# Altium schematic sheet Schematic.SchDoc
size A4
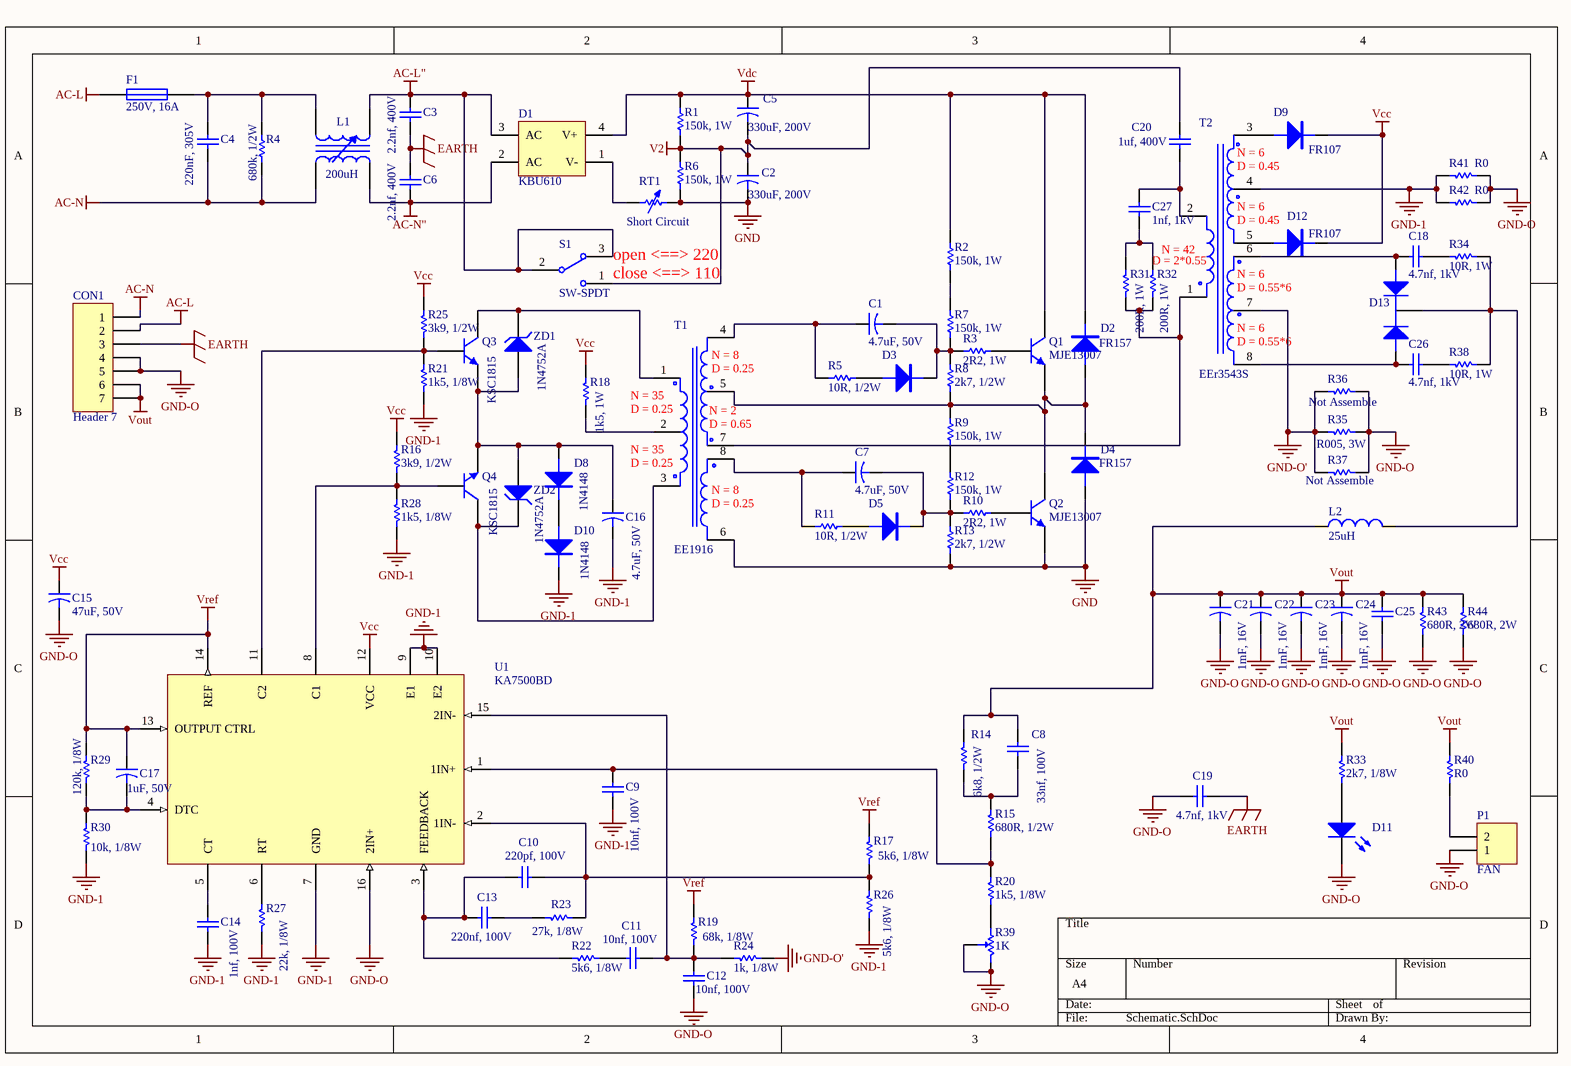
[diagram p0: Schematic.SchDoc]

## Parts
C1  4.7uF, 50V  [CAP-P2.54-D6]
C2  330uF, 200V  [C_EL_20X35]
C3  2.2nf, 400V  [C_CER_D7C]
C4  220nF, 305V  [CAP-pitch15]
C5  330uF, 200V  [C_EL_20X35]
C6  2.2nf, 400V  [C_CER_D7C]
C7  4.7uF, 50V  [CAP-P2.54-D6]
C8  33nf, 100V  [RAD0.2-1]
C9  10nf, 100V  [RAD0.2-1]
C10  220pf, 100V  [RAD0.2-1]
C11  10nf, 100V  [RAD0.2-1]
C12  10nf, 100V  [RAD0.2-1]
C13  220nf, 100V  [RAD0.2-1]
C14  1nf, 100V  [RAD0.2-1]
C15  47uF, 50V  [CAP-P2.54-D6]
C16  4.7uF, 50V  [CAP-P2.54-D6]
C17  1uF, 50V  [CAP-P2.54-D6]
C18  4.7nf, 1kV  [C_CER_D6B]
C19  4.7nf, 1kV  [RAD0.2-1]
C20  1uf, 400V  [C_PLY_22X7]
C21  1mF, 16V  [RB.2/.6-2]
C22  1mF, 16V  [RB.2/.6-2]
C23  1mF, 16V  [RB.2/.6-2]
C24  1mF, 16V  [RB.2/.6-2]
C25  (no value)  [C_CER_D6B]
C26  4.7nf, 1kV  [C_CER_D6B]
C27  1nf, 1kV  [C_CER_D6B]
CON1  Header 7  [barrier-terminal-7P]
D1  KBU610  [Diode-12]
D2  FR157  [D_AX05_DO15]
D3  (no value)  [D_AX04_DO41]
D4  FR157  [D_AX05_DO15]
D5  (no value)  [D_AX04_DO41]
D8  1N4148  [D_AX03_DO35]
D9  FR107  [D_AX04_DO41]
D10  1N4148  [D_AX03_DO35]
D11  LED RED  [LED3MM]  (value not drawn)
D12  FR107  [D_AX04_DO41]
D13  MBR20200CT  [TO-220ne3]  (value not drawn)
F1  250V, 16A  [Fuse -10]
L1  200uH  [Trans-11]
L2  25uH  [inductor-6]
P1  FAN  [XH_2]
Q1  MJE13007  [TO-220ne3]
Q2  MJE13007  [TO-220ne3]
Q3  KSC1815  [TO92_3B]
Q4  KSC1815  [TO92_3B]
R1  150k, 1W  [R05W_AX05]
R2  150k, 1W  [R05W_AX05]
R3  2R2, 1W  [R05W_AX05]
R4  680k, 1/2W  [R05W_AX05]
R5  10R, 1/2W  [R025W_AX04]
R6  150k, 1W  [R05W_AX05]
R7  150k, 1W  [R05W_AX05]
R8  2k7, 1/2W  [R025W_AX04]
R9  150k, 1W  [R05W_AX05]
R10  2R2, 1W  [R05W_AX05]
R11  10R, 1/2W  [R025W_AX04]
R12  150k, 1W  [R05W_AX05]
R13  2k7, 1/2W  [R025W_AX04]
R14  6k8, 1/2W  [R025W_AX04]
R15  680R, 1/2W  [R025W_AX04]
R16  3k9, 1/2W  [R025W_AX04]
R17  5k6, 1/8W  [R0125W_AX025]
R18  1k5, 1W  [R05W_AX05]
R19  68k, 1/8W  [R0125W_AX025]
R20  1k5, 1/8W  [R0125W_AX025]
R21  1k5, 1/8W  [R0125W_AX025]
R22  5k6, 1/8W  [R0125W_AX025]
R23  27k, 1/8W  [R0125W_AX025]
R24  1k, 1/8W  [R0125W_AX025]
R25  3k9, 1/2W  [R025W_AX04]
R26  5k6, 1/8W  [R0125W_AX025]
R27  22k, 1/8W  [R0125W_AX025]
R28  1k5, 1/8W  [R0125W_AX025]
R29  120k, 1/8W  [R0125W_AX025]
R30  10k, 1/8W  [R0125W_AX025]
R31  200R, 1W  [R1W_AX06]
R32  200R, 1W  [R1W_AX06]
R33  2k7, 1/8W  [R0125W_AX025]
R34  10R, 1W  [R05W_AX05]
R35  R005, 3W  [J10MM]
R36  Not Assemble  [J10MM]
R37  Not Assemble  [J10MM]
R38  10R, 1W  [R05W_AX05]
R39  1K  [Pot 00]
R40  R0  [J10MM]
R41  R0  [J7P6MM]
R42  R0  [J7P6MM]
R43  680R, 2W  [R1W_AX06]
R44  680R, 2W  [R1W_AX06]
RT1  Short Circuit  [J7P6MM]
S1  SW-SPDT  [Switch - SPDT]
T1  EE1916  [EE1916-3]
T2  EEr3543S  [EFD30_12]
U1  KA7500BD  [Dip-16pin]
ZD1  1N4752A  [Diode 1W]
ZD2  1N4752A  [Diode 1W]

## Nets
AC-L: CON1.2 F1.2
AC-L": C3.1 D1.3(AC) L1.2 S1.2 S1.3
AC-N: C4.2 CON1.1 L1.1 R4.2
AC-N": C6.2 D1.2(AC) L1.3
EARTH: C3.2 C6.1 C19.2 CON1.3
GND: C2.2 D4.1 Q2.1(E) R6.2 R13.2 RT1.2 T1.6
GND-1: C9.2 C14.2 C16.2 D10.2 R21.2 R26.2 R27.2 R28.2 R30.2 R41.2 R42.2 T2.4 U1.7(GND) U1.9(E1) U1.10(E2)
GND-O: C12.1 C15.2 C19.1 C21.2 C22.2 C23.2 C24.2 C25.2 CON1.4 CON1.5 D11.2(K) P1.1 R35.2 R36.1 R37.2 R39.1(CCW) R39.3(Setpoint) R41.1 R42.1 R43.1 R44.1 U1.16(2IN+)
GND-O': R24.2 R35.1 R36.2 R37.1 T2.7
V2: C2.1 C5.2 C20.1 R1.2 R6.1 S1.1
Vcc: C15.1 D9.2 D12.2 R16.1 R18.2 R25.1 U1.12(VCC)
Vdc: C5.1 D1.4(V+) D2.2 Q1.2(C) R1.1 R2.1
Vout: C8.1 C21.1 C22.1 C23.1 C24.1 C25.1 CON1.6 CON1.7 L2.1 R14.1 R33.1 R40.2 R43.2 R44.2
Vref: C17.1 R17.1 R19.1 R29.2 U1.13(OUTPUT_CTRL) U1.14(REF)
NetC1_1: C1.1 R5.2 T1.4
NetC1_2: C1.2 D3.2 R3.2 R7.2 R8.1
NetC4_1: C4.1 F1.1 L1.4 R4.1
NetC7_1: C7.1 R11.2 T1.8
NetC7_2: C7.2 D5.2 R10.2 R12.2 R13.1
NetC8_2: C8.2 R14.2 R15.1
NetC9_1: C9.1 R15.2 R20.2 U1.1(1IN+)
NetC10_1: C10.1 C13.1 R22.1 U1.3(FEEDBACK)
NetC10_2: C10.2 R17.2 R23.2 R26.1 U1.2(1IN-)
NetC11_1: C11.1 R22.2
NetC11_2: C11.2 C12.2 R19.2 R24.1 U1.15(2IN-)
NetC13_2: C13.2 R23.1
NetC14_1: C14.1 U1.5(CT)
NetC16_1: C16.1 D8.1 Q3.1(E) Q4.1(E) ZD1.1(A) ZD2.1(A)
NetC17_2: C17.2 R29.1 R30.1 U1.4(DTC)
NetC18_1: C18.1 R34.2
NetC18_2: C18.2 D13.3 T2.6
NetC20_2: C20.2 C27.1 T2.2
NetC26_1: C26.1 D13.1 T2.8
NetC26_2: C26.2 R38.2
NetC27_2: C27.2 R31.2 R32.2
NetD1_1: D1.1(V-) RT1.1
NetD2_1: D2.1 D4.2 Q1.1(E) Q2.2(C) R8.2 R9.1 T1.5
NetD3_1: D3.1 R5.1
NetD5_1: D5.1 R11.1
NetD8_2: D8.2 D10.1
NetD9_1: D9.1 T2.3
NetD11_1: D11.1(A) R33.2
NetD12_1: D12.1 T2.5
NetD13_2: D13.2 L2.2 R34.1 R38.1
NetP1_2: P1.2 R40.1
NetQ1_3: Q1.3(B) R3.1
NetQ2_3: Q2.3(B) R10.1
NetQ3_2: Q3.2(C) T1.1 ZD1.2(K)
NetQ3_3: Q3.3(B) R21.1 R25.2 U1.11(C2)
NetQ4_2: Q4.2(C) T1.3 ZD2.2(K)
NetQ4_3: Q4.3(B) R16.2 R28.1 U1.8(C1)
NetR2_2: R2.2 R7.1
NetR9_2: R9.2 R12.1
NetR18_1: R18.1 T1.2
NetR20_1: R20.1 R39.2(CW)
NetR27_1: R27.1 U1.6(RT)
NetR31_1: R31.1 R32.1 T1.7 T2.1

## Notes on the sheet
- (near T2) N = 6
- (near T2) D = 0.45
- D = 2*0.55
- N = 42
- open <==> 220                          close <==> 110
- (near T2) D = 0.55*6
- (near T1) N = 35
- (near T1) N = 8
- (near T1) D = 0.25
- (near T1) N = 2
- (near T1) D = 0.65

## Library data of the parts
C1 C2 C5 C7 C15-C17 C21-C24 = Cap2: 200V, 330uF; Category: Capacitor; Mounting Style: Through hole
  C1 C7 C16: Part Number: 4.7uF, 50V
  C2 C5: Part Number: 330uF, 200V
  C15: Part Number: 47uF, 50V
  C17: Part Number: 1uF, 50V
  C21-C24: Part Number: 1mF, 16V
C3 C6 = Cap: jn222m; Category: Capacitor; Mounting Style: Through hole; Part Number: 2.2nf, 400V
C4 = Cap: mkp62 x2  224 k 305v; Category: Capacitor; Mounting Style: Through hole; Part Number: 220nF, 305V
C8 = Cap: 2A333j; Category: Capacitor; Mounting Style: Through hole; Part Number: 33nf, 100V
C9 C11 C12 = Cap: 2A103j; Category: Capacitor; Mounting Style: Through hole; Part Number: 10nf, 100V
C10 = Cap: 2A221j; Category: Capacitor; Mounting Style: Through hole; Part Number: 220pf, 100V
C13 = Cap: 2A223j; Category: Capacitor; Mounting Style: Through hole; Part Number: 220nf, 100V
C14 = Cap: 2A102j; Category: Capacitor; Mounting Style: Through hole; Part Number: 1nf, 100V
C18 C19 C25-C27 = Cap: Category: Capacitor; Mounting Style: Through hole
  C18 C19 C26: Part Number: 4.7nf, 1kV
  C27: Part Number: 1nf, 1kV
C20 = Cap: ceramic; Category: Capacitor; Mounting Style: Through hole; Part Number: 1uf, 400V
CON1 = Header 7: Header, 7-Pin; LatestRevisionDate: 17-Jul-2002; LatestRevisionNote: Re-released for DXP Platform.; Publisher: Altium Limited
D1 = Bridge: 35A, 1200V; MAnufacturer: HY Electronic; Category: Diode; Part Number: KBU610; Mounting Style: Through Hole
D2-D5 D8-D10 D12 = DIODE5: MAnufacturer: Comchip Technology; Category: Diode; Mounting Style: Through hole; Package: DO-15
  D2 D4: Part Number: FR157
  D8 D10: Part Number: 1N4148
  D9 D12: Part Number: FR107
D11 = LED0: Typical INFRARED GaAs LED; Layer: Top; Category: LED; Mounting Style: Through Hole
D13 = Diode 3pin: MAnufacturer: ON; Category: Diode; Mounting Style: Through hole; Package: TO-220; Part Number: MBR20200CT
F1 = Fuse 1: Fuse; Category: Fuse; Part Number: 250V, 16A
L1 = Trans Adj: MAnufacturer: click; Category: Inductor; Mounting Style: Through hole; Part Number: 200uH
L2 = Inductor: 260-04930-10E   082-10394-01    click      1929; Category: Inductor; MAnufacturer: click; Mounting Style: Through hole; Part Number: 25uH
P1 = Header 2: Header, 2-Pin; Part Number: FAN
Q1 Q2 = QNPN: MAnufacturer: ON; Category: transistor; Mounting Style: Through hole; Package: TO-220; Part Number: MJE13007
Q3 Q4 = QNPN: Category: transistor; Mounting Style: Through hole; Part Number: KSC1815
R1-R38 R40-R42 R44 = Res1: Resistor; Category: Resistor; Mounting Style: Through hole
  R1 R2 R6 R7 R9 R12: Part Number: 150k, 1W
  R3 R10: Part Number: 2R2, 1W
  R4: Part Number: 680k, 1/2W
  R5 R11: Part Number: 10R, 1/2W
  R8 R13: Part Number: 2k7, 1/2W
  R14: Part Number: 6k8, 1/2W
  R15: Part Number: 680R, 1/2W
  R16 R25: Part Number: 3k9, 1/2W
  R17 R22 R26: Part Number: 5k6, 1/8W
  R18: Part Number: 1k5, 1W
  R19: Part Number: 68k, 1/8W
  R20 R21 R28: Part Number: 1k5, 1/8W
  R23: Part Number: 27k, 1/8W
  R24: Part Number: 1k, 1/8W
  R27: Part Number: 22k, 1/8W
  R29: Part Number: 120k, 1/8W
  R30: Part Number: 10k, 1/8W
  R31 R32: Part Number: 200R, 1W
  R33: Part Number: 2k7, 1/8W
  R34 R38: Part Number: 10R, 1W
  R35: Part Number: R005, 3W
  R36 R37: Part Number: Not Assemble
  R40-R42: Part Number: R0
  R44: Part Number: 680R, 2W
R39 = Resistor Variable: Variable Resistor; Designer: Saeid Jorablo; Company: ControTec; Adding Date: 137/12/22; Value: 1K
R43 = Res1: NA; Category: Resistor; Mounting Style: Through hole; Part Number: NA
RT1 = Res Adj1: Category: Resistor; Part Number: Short Circuit
S1 = SW-SPDT: SPDT Subminiature Toggle Switch, Right Angle Mounting, Vertical Actuation; Published: 24-Mar-1999; LatestRevisionDate: 17-Dec-2003; LatestRevisionNote: Schematic revised, PCB Footprint replaced.; DatasheetVersion: 05-Dec-2000; PackageReference: TL36WW15050; Publisher: Altium Limited; PackageDescription: Switch; 4 Leads; ComponentLink1Description: Manufacturer Link; ComponentLink1URL: http://www.apem.com
T1 = Transformers 78253 Series_1
T2 = Transformers 78253 Series_2
U1 = KA7500BD: TEXAS INSTRUMENTS - TL494CN - VOLTAGE MODE PWM CONTROLLER, 40V, 16-DIP; Number of Outputs: 2; Max Frequency: 300kHz; Duty Cycle: 45%; Topology: Flyback,Push-Pull; Output Current: 200mA; Rise Time: 100ns; Fall Time: 40ns; Min Supply Voltage: 7V; Reference Voltage: 5V; Tolerance: 5%; Supplier 1: Digi-Key; Manufacturer: Texas Instruments; Manufacturer Part Number: TL494CN; RoHS: Yes; Category: Voltage Regulators - Switching; Stock 1: 2444; Pricing 1: 1=0.53000, 10=0.45000, 25=0.42000, 100=0.31200, 250=0.26400, 500=0.25200, 1000=0.18600, 2500=0.17400, 5000=0.16200 (USD); Case/Package: N; Number of Pins: 16; Weight: 0.03357oz; Min Operating Temperature: -40°C; Max Operating Temperature: 85°C; Output Voltage: 40V; Packaging: Rail/Tube; Package Quantity: 25; Switching Frequency: 300kHz; Max Supply Voltage: 40V; Max Duty Cycle: 45%; Frequency: 300kHz; Length: 19.3mm; Width: 6.35mm; Height: 4.57mm; Radiation Hardening: No; Lead Free: Lead Free; REACH SVHC: No SVHC; ComponentLink1URL: https://datasheet.ciiva.com/2015/tl494-2015344.pdf?src-supplier=Digi-Key; ComponentLink1Description: https://datasheet.ciiva.com/2015/tl494-2015344.pdf?src-supplier=Digi-Key; ComponentLink2URL: https://datasheet.ciiva.com/15106/getdatasheetpartid-48475-15106722.pdf?src-supplier=Verical; ComponentLink2Description: https://datasheet.ciiva.com/15106/getdatasheetpartid-48475-15106722.pdf?src-supplier=Verical; ComponentLink3URL: https://datasheet.ciiva.com/14171/ed644262-14171131.pdf?src-supplier=Distrelec; ComponentLink3Description: https://datasheet.ciiva.com/14171/ed644262-14171131.pdf?src-supplier=Distrelec; ComponentLink4URL: https://datasheet.ciiva.com/29305/181455-an-01-pl-tl494c-29305529.pdf?src-supplier=Conrad; ComponentLink4Description: https://datasheet.ciiva.com/29305/181455-an-01-pl-tl494c-29305529.pdf?src-supplier=Conrad; ComponentLink5URL: https://datasheet.ciiva.com/1513/1829924-1513075.pdf?src-supplier=Element14; ComponentLink5Description: https://datasheet.ciiva.com/1513/1829924-1513075.pdf?src-supplier=Element14; ComponentLink6URL: https://datasheet.ciiva.com/26229/tl494-26229306.pdf?src-supplier=Avnet+Europe; ComponentLink6Description: https://datasheet.ciiva.com/26229/tl494-26229306.pdf?src-supplier=Avnet+Europe; Supplier Part Number 1: 296-1799-5-ND
ZD1 ZD2 = D Zener: 25V Zener Diode; Category: Diode; Part Number: 1N4752A